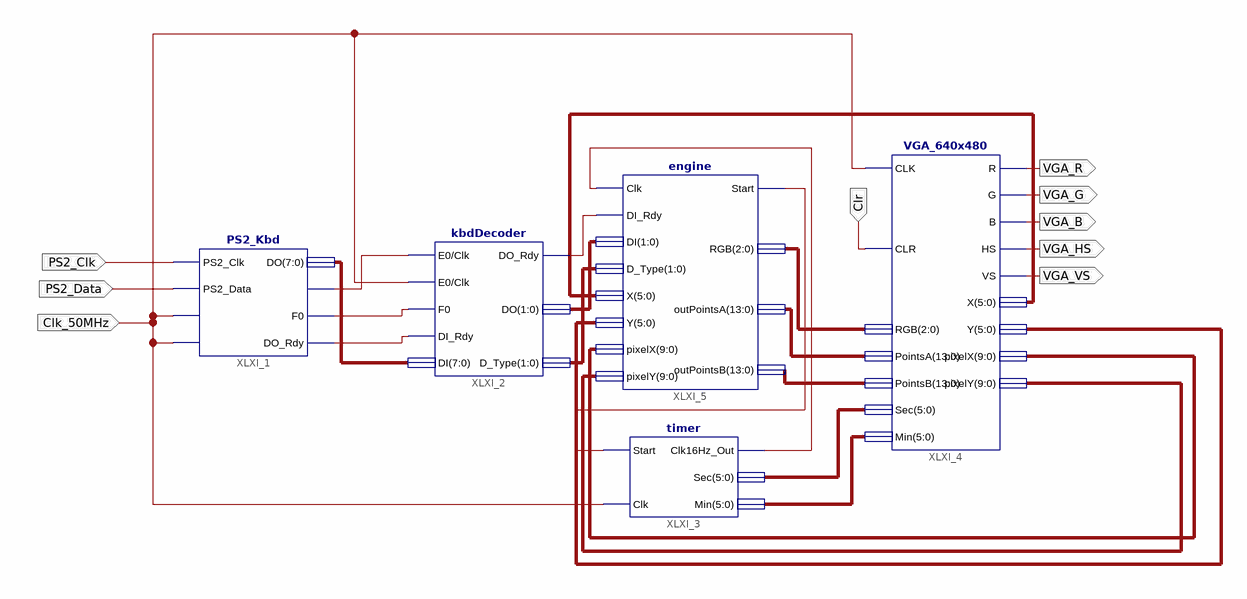
[diagram p0: schematic sheet 1]
// Xilinx ISE schematic test.sch (spartan3e) as structural Verilog: 5 symbols, 9 ports
module test (
  input  PS2_Clk,
  input  PS2_Data,
  input  Clk_50MHz,
  input  Clr,
  output VGA_R,
  output VGA_G,
  output VGA_B,
  output VGA_HS,
  output VGA_VS
);

  wire XLXN_8, XLXN_9, XLXN_24, XLXN_25, XLXN_26;
  wire [1:0] XLXN_27, XLXN_28;
  wire [2:0] XLXN_21;
  wire [5:0] XLXN_19, XLXN_20, XLXN_29, XLXN_30;
  wire [7:0] XLXN_6;
  wire [9:0] XLXN_31, XLXN_32;
  wire [13:0] XLXN_22, XLXN_23;

  PS2_Kbd XLXI_1 (
    .PS2_Clk(PS2_Clk), .PS2_Data(PS2_Data), .Clk_50MHz(Clk_50MHz), .E0(Clk_50MHz), .F0(XLXN_8),
    .DO_Rdy(XLXN_9), .DO(XLXN_6), .Clk_Sys(Clk_50MHz));
  kbdDecoder XLXI_2 (
    .E0(Clk_50MHz), .Clk(Clk_50MHz), .F0(XLXN_8), .DI_Rdy(XLXN_9), .DI(XLXN_6), .DO_Rdy(XLXN_26),
    .DO(XLXN_27), .D_Type(XLXN_28));
  timer XLXI_3 (.Start(XLXN_24), .Clk(Clk_50MHz), .Clk16Hz_Out(XLXN_25), .Sec(XLXN_19), .Min(XLXN_20));
  VGA_640x480 XLXI_4 (
    .CLK(Clk_50MHz), .CLR(Clr), .RGB(XLXN_21), .PointsA(XLXN_22), .PointsB(XLXN_23), .Sec(XLXN_19),
    .Min(XLXN_20), .R(VGA_R), .G(VGA_G), .B(VGA_B), .HS(VGA_HS), .VS(VGA_VS), .X(XLXN_29), .Y(XLXN_30),
    .pixelX(XLXN_31), .pixelY(XLXN_32));
  engine XLXI_5 (
    .Clk(XLXN_25), .DI_Rdy(XLXN_26), .DI(XLXN_27), .D_Type(XLXN_28), .X(XLXN_29), .Y(XLXN_30),
    .pixelX(XLXN_31), .pixelY(XLXN_32), .Start(XLXN_24), .RGB(XLXN_21), .outPointsA(XLXN_22),
    .outPointsB(XLXN_23));
endmodule
